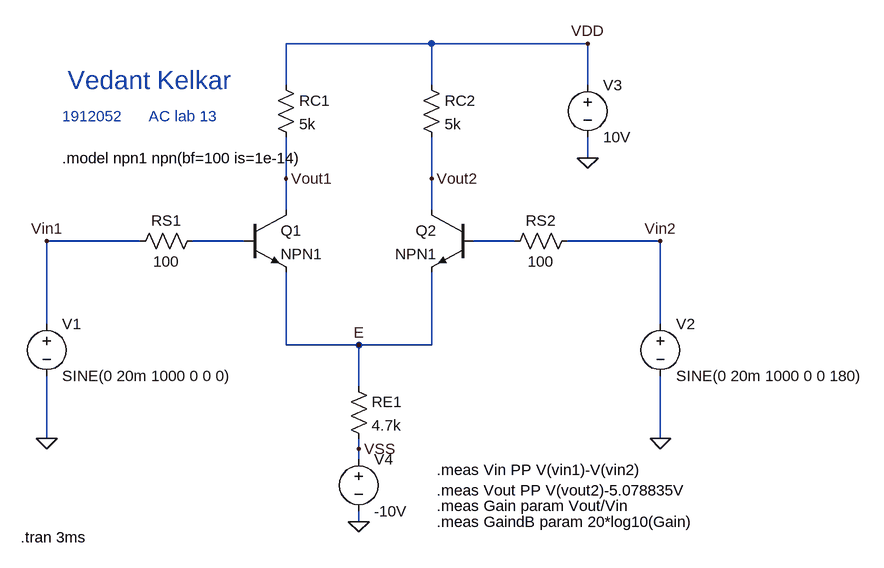
[diagram p0: schematic AC_Lab13b.asc]
AC_Lab13b.asc, the LTspice schematic file:
Version 4
SHEET 1 880 680
WIRE 192 -96 -32 -96
WIRE 432 -96 192 -96
WIRE -32 -32 -32 -96
WIRE 192 -32 192 -96
WIRE 432 -32 432 -96
WIRE 432 80 432 48
WIRE -32 112 -32 48
WIRE 192 112 192 48
WIRE -32 160 -32 112
WIRE 192 160 192 112
WIRE -256 208 -400 208
WIRE -96 208 -176 208
WIRE 320 208 256 208
WIRE 544 208 400 208
WIRE -400 336 -400 208
WIRE 544 336 544 208
WIRE -32 368 -32 256
WIRE 80 368 -32 368
WIRE 192 368 192 256
WIRE 192 368 80 368
WIRE 80 432 80 368
WIRE -400 512 -400 416
WIRE 544 512 544 416
WIRE 80 528 80 512
WIRE 80 544 80 528
WIRE 80 640 80 624
FLAG -400 512 0
FLAG 544 512 0
FLAG 80 368 E
FLAG 432 80 0
FLAG 80 640 0
FLAG 432 -96 VDD
FLAG 80 528 VSS
FLAG 544 208 Vin2
FLAG -400 208 Vin1
FLAG -32 112 Vout1
FLAG 192 112 Vout2
SYMBOL voltage -400 320 R0
WINDOW 123 0 0 Left 0
WINDOW 39 0 0 Left 0
SYMATTR InstName V1
SYMATTR Value SINE(0 20m 1000 0 0 0)
SYMBOL res -160 192 R90
WINDOW 0 0 56 VBottom 2
WINDOW 3 32 56 VTop 2
SYMATTR InstName RS1
SYMATTR Value 100
SYMBOL npn -96 160 R0
SYMATTR InstName Q1
SYMATTR Value NPN1
SYMBOL res -48 -48 R0
SYMATTR InstName RC1
SYMATTR Value 5k
SYMBOL voltage 544 320 R0
WINDOW 123 0 0 Left 0
WINDOW 39 0 0 Left 0
SYMATTR InstName V2
SYMATTR Value SINE(0 20m 1000 0 0 180)
SYMBOL res 416 192 R90
WINDOW 0 0 56 VBottom 2
WINDOW 3 32 56 VTop 2
SYMATTR InstName RS2
SYMATTR Value 100
SYMBOL npn 256 160 M0
SYMATTR InstName Q2
SYMATTR Value NPN1
SYMBOL res 176 -48 R0
SYMATTR InstName RC2
SYMATTR Value 5k
SYMBOL res 64 416 R0
SYMATTR InstName RE1
SYMATTR Value 4.7k
SYMBOL voltage 432 -48 R0
WINDOW 123 0 0 Left 0
WINDOW 39 0 0 Left 0
SYMATTR InstName V3
SYMATTR Value 10V
SYMBOL voltage 80 528 R0
WINDOW 123 0 0 Left 0
WINDOW 39 0 0 Left 0
SYMATTR InstName V4
SYMATTR Value -10V
TEXT -368 -40 Left 4 ;Vedant Kelkar
TEXT -376 16 Left 2 ;1912052      AC lab 13
TEXT -376 80 Left 2 !.model npn1 npn(bf=100 is=1e-14)
TEXT -440 664 Left 2 !.tran 3ms
TEXT 200 560 Left 2 !.meas Vin PP V(vin1)-V(vin2)
TEXT 200 592 Left 2 !.meas Vout PP V(vout2)-5.078835V
TEXT 200 616 Left 2 !.meas Gain param Vout/Vin
TEXT 200 640 Left 2 !.meas GaindB param 20*log10(Gain)

The netlist it stands for:
* AC_Lab13b.asc
V1 Vin1 0 SINE(0 20m 1000 0 0 0)
RS1 N001 Vin1 100
Q1 Vout1 N001 E 0 NPN1
RC1 VDD Vout1 5k
V2 Vin2 0 SINE(0 20m 1000 0 0 180)
RS2 Vin2 N002 100
Q2 Vout2 N002 E 0 NPN1
RC2 VDD Vout2 5k
RE1 E VSS 4.7k
V3 VDD 0 10V
V4 VSS 0 -10V
.model NPN NPN
.model PNP PNP
.lib standard.bjt
* Vedant Kelkar
* 1912052      AC lab 13
.model npn1 npn(bf=100 is=1e-14)
.tran 3ms
.meas Vin PP V(vin1)-V(vin2)
.meas Vout PP V(vout2)-5.078835V
.meas Gain param Vout/Vin
.meas GaindB param 20*log10(Gain)
.backanno
.end